# EAGLE schematic amp-PA-UHF-TQP7M9106 (EAGLE 9.2.2)
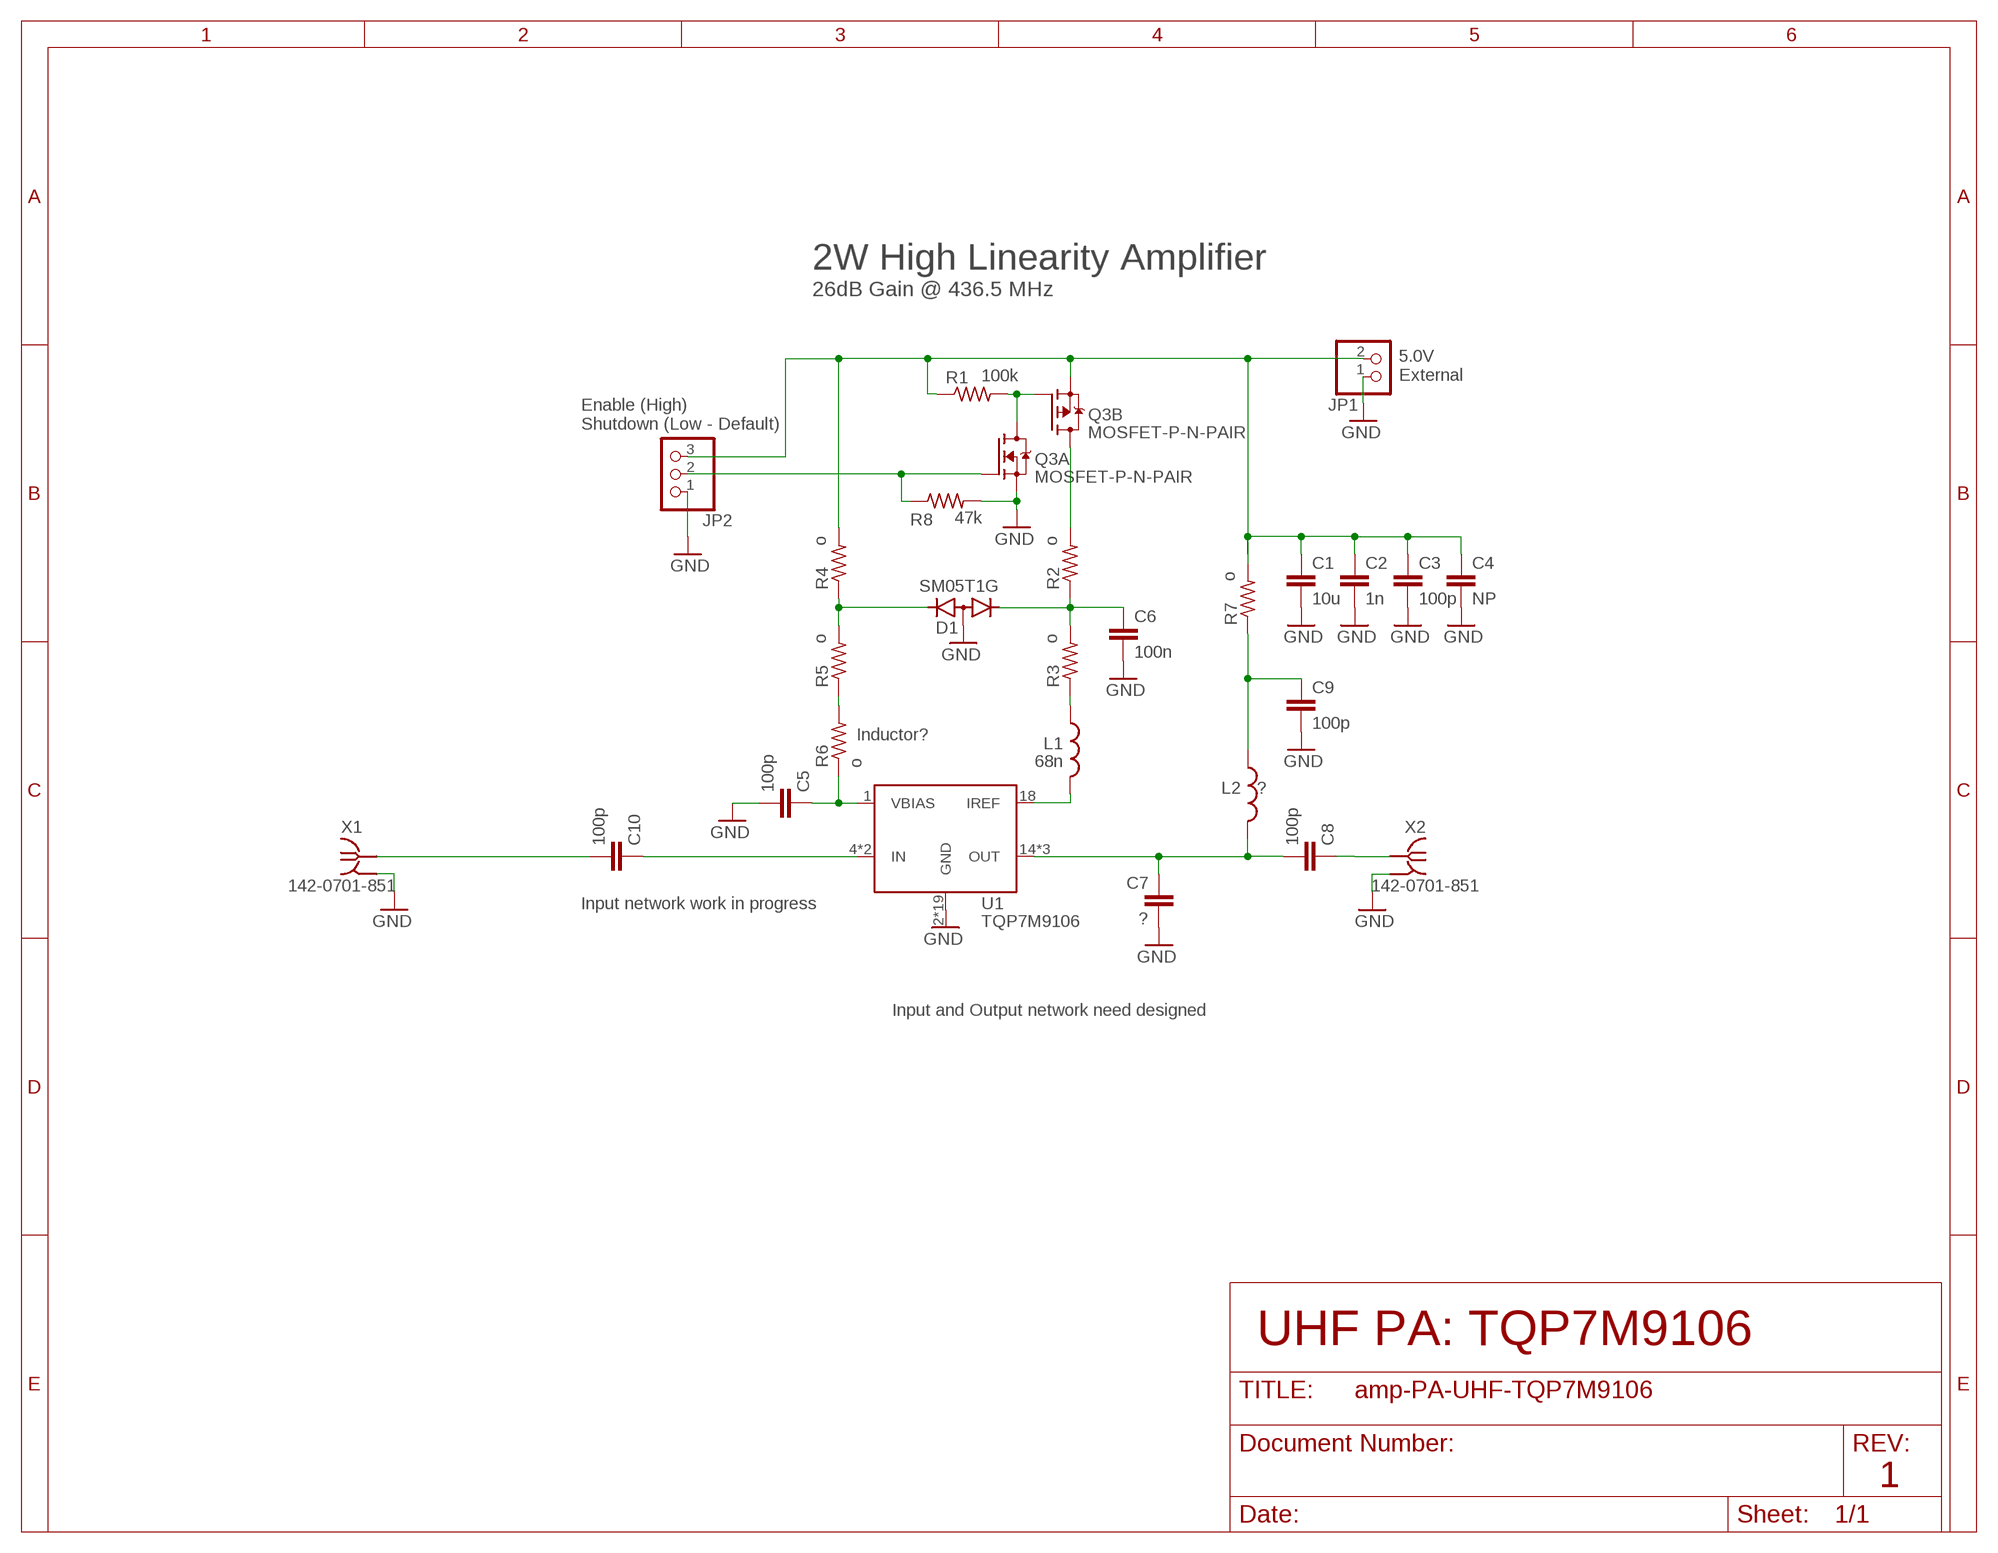
[diagram p0: schematic, sheet 1]

## Parts
C1  10u  C-EU0603-B-NOSILK  [.0603-B-NOSILK]
C2  1n  C-EU0603-B-NOSILK  [.0603-B-NOSILK]
C3  100p  C-EU0603-B-NOSILK  [.0603-B-NOSILK]
C4  NP  C-EU0603-B-NOSILK  [.0603-B-NOSILK]
C5  100p  C-EU0603-B-NOSILK  [.0603-B-NOSILK]
C6  100n  C-EU0603-B-NOSILK  [.0603-B-NOSILK]
C7  ?  C-EU0402-B-NOSILK  [.0402-B-NOSILK]
C8  100p  C-EU0402-B-NOSILK  [.0402-B-NOSILK]
C9  100p  C-EU0603-B-NOSILK  [.0603-B-NOSILK]
C10  100p  C-EU0402-B-NOSILK  [.0402-B-NOSILK]
D1  SM05T1G  DIODE-2CA|ACSOT23  [SOT23]
JP1  PINHD-1X2  [1X02]
JP2  PINHD-1X3  [1X03]
L1  68n  L-US0603-B-NOSILK  [.0603-B-NOSILK]
L2  ?  L-US0805-B-NOSILK  [.0805-B-NOSILK]
Q3  MOSFET-P-N-PAIR  [SOT23-6]
R1  100k  R-US_0402-B-NOSILK  [.0402-B-NOSILK]
R2  o  R-US_0805-B-NOSILK  [.0805-B-NOSILK]
R3  o  R-US_0603-B-NOSILK  [.0603-B-NOSILK]
R4  o  R-US_0805-B-NOSILK  [.0805-B-NOSILK]
R5  o  R-US_0603-B-NOSILK  [.0603-B-NOSILK]
R6  o  R-US_0603-B-NOSILK  [.0603-B-NOSILK]
R7  o  R-US_0805-B-NOSILK  [.0805-B-NOSILK]
R8  47k  R-US_0402-B-NOSILK  [.0402-B-NOSILK]
U1  TQP7M9106  [QFN24-4X4-WITH-PAD]
X1  142-0701-851  [142-0701-851]
X2  142-0701-851  [142-0701-851]

## Nets
GND: C1.2 C2.2 C3.2 C4.2 C5.2 C6.2 C7.2 C9.2 D1.3(A) JP1.1 JP2.1 Q3.5(A:S) R8.2 U1.2(GND) U1.3(GND) U1.6(GND) U1.7(GND) U1.8(GND) U1.9(GND) U1.10(GND) U1.11(GND) U1.12(GND) U1.13(GND) U1.17(GND) U1.19(GND) U1.20(GND) U1.21(GND) U1.22(GND) U1.23(GND) U1.24(GND) U1.BPAD(GND) U1.TPAD(GND) X1.GND1(GND) X1.GND2(GND) X1.GND3(GND) X1.GND4(GND) X2.GND1(GND) X2.GND2(GND) X2.GND3(GND) X2.GND4(GND)
N$1: C9.1 L2.1 R7.1
N$2: Q3.4(B:D) R2.2
N$3: R5.1 R6.2
N$4: L1.1 R3.1
N$5: Q3.3(B:G) Q3.6(A:D) R1.2
N$6: C10.2 X1.RF1(RF)
N$7: JP2.2 Q3.1(A:G) R8.1
N$8: C10.1 U1.4(IN) U1.5(IN)
N$66: D1.2(K2) R4.1 R5.2
N$67: C8.1 X2.RF1(RF)
N$68: L1.2 U1.18(IREF)
N$69: C7.1 C8.2 L2.2 U1.14(OUT) U1.15(OUT) U1.16(OUT)
N$70: C6.1 D1.1(K1) R2.1 R3.2
N$72: C1.1 C2.1 C3.1 C4.1 JP1.2 JP2.3 Q3.2(B:S) R1.1 R4.2 R7.2
N$73: C5.1 R6.1 U1.1(VBIAS)

## Notes on the sheet
- 2W High Linearity Amplifier
- 26dB Gain @ 436.5 MHz
- 5.0V
  External
- Enable (High)
  Shutdown (Low - Default)
- Inductor?
- Input network work in progress
- Input and Output network need designed
- UHF PA: TQP7M9106
- 1

## Library data of the parts
C1-C10 = oresat-rcl:C-EU: CAPACITOR, European symbol
D1 = diode:DIODE-2CA|AC: Dual DIODE Cathode-Anode|Anode-Cathode
JP1 = pinhead:PINHD-1X2: PIN HEADER
JP2 = pinhead:PINHD-1X3: PIN HEADER
L1 L2 = oresat-rcl:L-US: INDUCTOR, American symbol
Q3 = Q-MOSFET-NP-Pair-SOT23-6:MOSFET-P-N-PAIR
R1-R8 = oresat-rcl:R-US_: RESISTOR, American symbol
U1 = U-Qorvo-TQP7M9106-PA:TQP7M9106: 2W High Linearity RF Amplifier, 50 - 1500 MHz
X1 X2 = J-Cinch-142-0701-851-SMA-end-launch:142-0701-851: SMA Jack 50Ω - End Launch Source: Datasheet <https://belfuse.com/resources/productinformations/cinchconnectivitysolutions/johnson/pi-ccs-john-142-0701-851.pdf>